# Altium project Rev1.PrjPCB
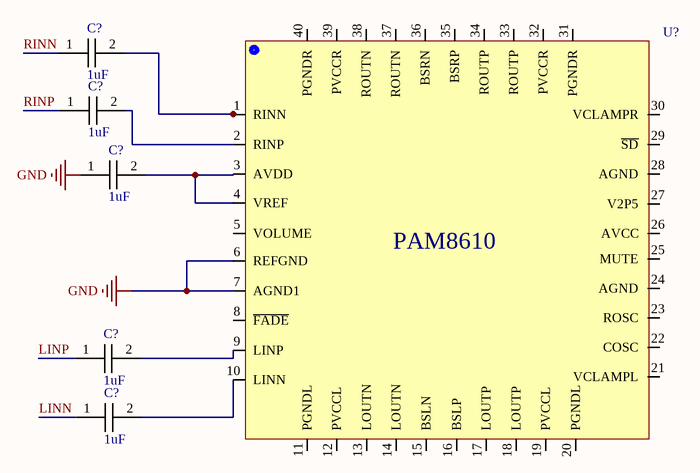
[diagram p0: Rev1.SchDoc]
1 sheet, 6 parts. Net scope: global (net labels, ports and power ports of the same name join across sheets).
Board file: Rev1.PcbDoc

## Sheet Rev1.SchDoc
size A4

### Parts
(Parts that share a designator on the sheet are numbered #1, #2 ... from top to bottom, then left to right.)
C?#1  1uF  [CAP-0805]
C?#2  1uF  [CAP-0805]
C?#3  1uF  [CAP-0805]
C?#4  1uF  [CAP-0805]
C?#5  1uF  [CAP-0805]
U?  PAM8610  [PAM8610]  (value not drawn)

### Nets
GND: C?#3.1 U?.6(REFGND) U?.7(AGND1)
LINN: C?#5.1
LINP: C?#4.1
RINN: C?#1.1
RINP: C?#2.1
NetC?#1_2: C?#1.2 U?.1(RINN)
NetC?#2_2: C?#2.2 U?.2(RINP)
NetC?#3_2: C?#3.2 U?.3(AVDD) U?.4(VREF)
NetC?#4_2: C?#4.2 U?.9(LINP)
NetC?#5_2: C?#5.2 U?.10(LINN)

Not connected (* = marked no-connect by the designer): U? 5(VOLUME) 8(~{FADE}) 11(PGNDL) 12(PVCCL) 13(LOUTN) 14(LOUTN) 15(BSLN) 16(BSLP) 17(LOUTP) 18(LOUTP) 19(PVCCL) 20(PGNDL) 21(VCLAMPL) 22(COSC) 23(ROSC) 24(AGND) 25(MUTE) 26(AVCC) 27(V2P5) 28(AGND) 29(~{SD}) 30(VCLAMPR) 31(PGNDR) 32(PVCCR) 33(ROUTP) 34(ROUTP) 35(BSRP) 36(BSRN) 37(ROUTN) 38(ROUTN) 39(PVCCR) 40(PGNDR)

### Library data of the parts
C?#1-C?#5 = CAP-0805: Manufacturer: Murata; Manufacturer Part Number: GRM21BR61C106KE15L; Description: CAP CER 10UF 16V X5R 0805; Material: Ceramic; Capacitance: 10uF; Tolerance: 10%; Voltage Rating: 16V; Dielectric: X5R; Supplier 1: Digi-Key; Supplier Part Number 1: 490-3886-6-ND; Stock 1: 5251894; Pricing 1: 1=0.32, 10=0.216, 100=0.1224, 500=0.0864, 1000=0.0756 (USD); Mount: Surface Mount; Case/Package: 0805; Case Code (Imperial): 0805; Case Code (Metric): 2012; Min Operating Temperature: -55°C; Max Operating Temperature: 85°C; Packaging: Tape and Reel; Voltage Rating (DC): 16V; Package Quantity: 1; Termination: SMD/SMT; Voltage: 16V; Length: 2mm; Height: 1.25mm; Width: 1.25mm; Depth: 1.25mm; Thickness: 0.053inch; Radiation Hardening: No; Lead Free: Lead Free; REACH SVHC: No SVHC; ComponentLink1URL: http://search.murata.co.jp/Ceramy/image/img/A01X/G101/ENG/GRM21BR61C106KE15-01.pdf; ComponentLink1Description: http://search.murata.co.jp/Ceramy/image/img/A01X/G101/ENG/GRM21BR61C106KE15-01.pdf; ComponentLink2URL: http://psearch.en.murata.com/capacitor/product/GRM21BR61C106KE15%23.pdf; ComponentLink2Description: http://psearch.en.murata.com/capacitor/product/GRM21BR61C106KE15%23.pdf; ComponentLink3URL: http://components.arrow.com/part/dataview/43432906S7256579N2606; ComponentLink3Description: http://components.arrow.com/part/dataview/43432906S7256579N2606; ComponentLink4URL: http://www.farnell.com/datasheets/2048774.pdf; ComponentLink4Description: http://www.farnell.com/datasheets/2048774.pdf; ComponentLink5URL: http://www.produktinfo.conrad.com/datenblaetter/450000-474999/450891-da-01-de-VS_CHIP_KOND_0805_10_0_UF_10Pr_16_0V_X5R.pdf; ComponentLink5Description: http://www.produktinfo.conrad.com/datenblaetter/450000-474999/450891-da-01-de-VS_CHIP_KOND_0805_10_0_UF_10Pr_16_0V_X5R.pdf; ComponentLink6URL: http://www.produktinfo.conrad.com/datenblaetter/450000-474999/454607-da-01-en-VS_KONDENSATOR_0805.pdf; ComponentLink6Description: http://www.produktinfo.conrad.com/datenblaetter/450000-474999/454607-da-01-en-VS_KONDENSATOR_0805.pdf
U? = PAM8610: 10W Stereo Class-D Audio Power Amplifier with DC Volume Control; Manufacturer: Diodes; Manufacturer Part Number: PAM8610TR; Min Supply Voltage: 7V; Max Supply Voltage: 15V; Power Supply Rejection Ratio (PSRR): 60dB; Supplier 1: Digi-Key; Stock 1: 1422; Pricing 1: 1=2.1, 10=1.883, 100=1.5138, 500=1.2437, 1000=1.0305 (USD); Mount: Surface Mount; Case/Package: QFN; Min Operating Temperature: -20°C; Max Operating Temperature: 85°C; Package Quantity: 2500; Packaging: Tape and Reel; Max Output Power: 10W; Radiation Hardening: No; ComponentLink1URL: https://www.diodes.com/assets/Datasheets/PAM8610.pdf; ComponentLink1Description: https://www.diodes.com/assets/Datasheets/PAM8610.pdf; ComponentLink2URL: http://www.mouser.com/ds/2/115/PAM8610-247304.pdf; ComponentLink2Description: http://www.mouser.com/ds/2/115/PAM8610-247304.pdf; Supplier Part Number 1: PAM8610TRDIDKR-ND